# Altium schematic sheet SuperBC.SchDoc: =GSGS
size A3; Engineer: aloha; Address1: Unska 3; Address2: 10000 Zagreb; Address3: Croatia; SheetNumber: 2; SheetTotal: 4; : 2
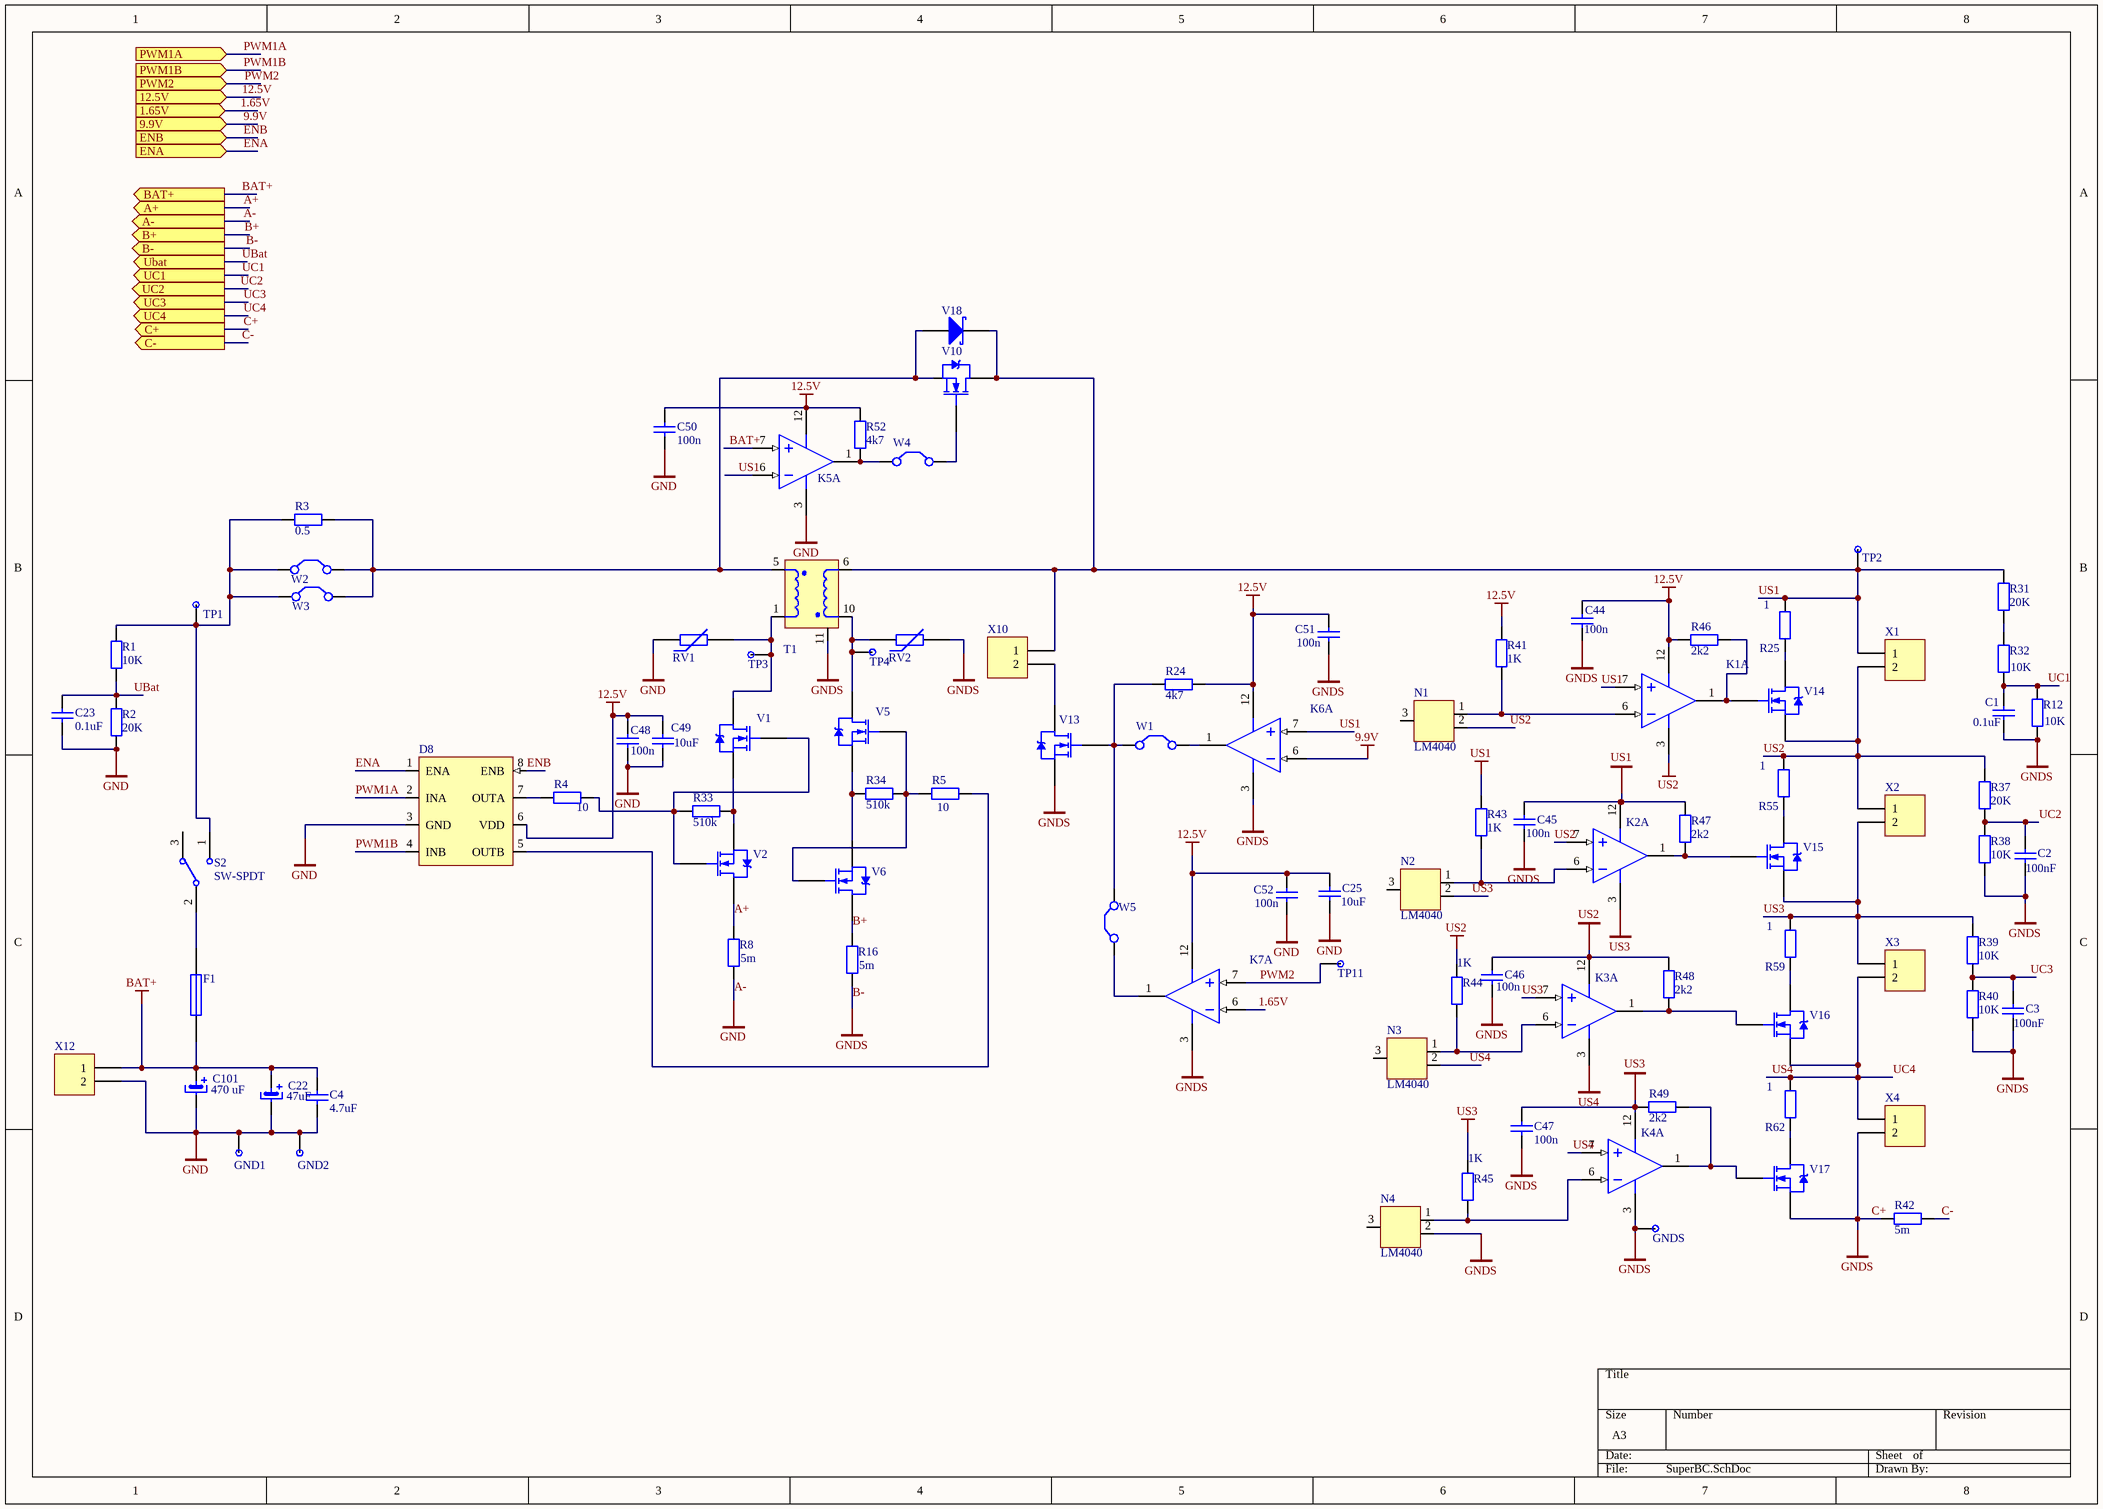
[diagram p0: SuperBC.SchDoc]

## Parts
C1  0.1uF  [C1210_L]
C2  value 100nF  [C1210_L]  (hidden comment: 0.1uF)
C3  value 100nF  [C1210_L]  (hidden comment: 0.1uF)
C4  4.7uF  [C0805]
C22  47uF  [SMD_CAP_RAD_8X10.2]
C23  0.1uF  [C1210_L]
C25  10uF  [C1210_L]
C44  100n  [C0805]
C45  100n  [C0805]
C46  100n  [C0805]
C47  100n  [C0805]
C48  100n  [C0805]
C49  10uF  [C1210_L]
C50  100n  [C0805]
C51  100n  [C0805]
C52  100n  [C0805]
C101  470 uF  [SMD_CAP_RAD_8X10.2]
D8  driver_mosfet  [SOIC8]  (value not drawn)
F1  Fuse 1  [C1206]  (value not drawn)
GND1  *  (value not drawn)
GND2  *  (value not drawn)
GNDS  *  (value not drawn)
K1  TLC3704QJ  [SOT-23]  (value not drawn)  (part A of 4)
K2  TLC3704QJ  [SOT-23]  (value not drawn)  (part A of 4)
K3  TLC3704QJ  [SOT-23]  (value not drawn)  (part A of 4)
K4  TLC3704QJ  [SOT-23]  (value not drawn)  (part A of 4)
K5  NCS2200  [SOT-23]  (value not drawn)  (part A of 4)
K6  TLC3704QJ  [SOT-23]  (value not drawn)  (part A of 4)
K7  TLC3704QJ  [SOT-23]  (value not drawn)  (part A of 4)
N1  LM4040  [SOT-23-ref_chip]
N2  LM4040  [SOT-23-ref_chip]
N3  LM4040  [SOT-23-ref_chip]
N4  LM4040  [SOT-23-ref_chip]
R1  10K  [C1210_L]
R2  20K  [C1210_L]
R3  0.5  [C2512]
R4  10  [C0805]
R5  10  [C0805]
R8  5m  [otpornik R8, R16]
R12  10K  [C1210_L]
R16  5m  [otpornik R8, R16]
R24  4k7  [C1206]
R25  1  [F za 7W otpornik]
R31  20K  [C1210_L]
R32  10K  [C1210_L]
R33  510k  [C1210_L]
R34  510k  [C1210_L]
R37  20K  [C1210_L]
R38  10K  [C1210_L]
R39  10K  [C1210_L]
R40  10K  [C1210_L]
R41  1K  [C1210_L]
R42  5m  [otpornik R8, R16]
R43  1K  [C1210_L]
R44  1K  [C1210_L]
R45  1K  [C1210_L]
R46  2k2  [C1210_L]
R47  2k2  [C1210_L]
R48  2k2  [C1210_L]
R49  2k2  [C1210_L]
R52  4k7  [C1206]
R55  1  [F za 7W otpornik]
R59  1  [F za 7W otpornik]
R62  1  [F za 7W otpornik]
RV1  Res Varistor  [C1210_L]  (value not drawn)
RV2  Res Varistor  [C1210_L]  (value not drawn)
S2  SW-SPDT  [toggle_switch]
T1  transformator  [F za transformator]  (value not drawn)
TP1  *  (value not drawn)
TP2  *  (value not drawn)
TP3  *  (value not drawn)
TP4  *  (value not drawn)
TP11  *  (value not drawn)
V1  NMOS-2  [SO-8L single_f]  (value not drawn)
V2  NMOS-2  [SO-8L single_f]  (value not drawn)
V5  NMOS-2  [SO-8L single_f]  (value not drawn)
V6  NMOS-2  [SO-8L single_f]  (value not drawn)
V10  MOSFET-N  [TO-252-3]  (value not drawn)
V13  MOSFET-N  [TO-252-3]  (value not drawn)
V14  NMOS-2  [SO-8L single_f]  (value not drawn)
V15  NMOS-2  [SO-8L single_f]  (value not drawn)
V16  NMOS-2  [SO-8L single_f]  (value not drawn)
V17  NMOS-2  [SO-8L single_f]  (value not drawn)
V18  Schottky Diode  [TO-220-AB]  (value not drawn)
W1  Jumper  [HDR1X2]  (value not drawn)
W2  Jumper 4.3A  [HDR1X2]  (value not drawn)
W3  Jumper 4.3A  [HDR1X2]  (value not drawn)
W4  Jumper  [HDR1X2]  (value not drawn)
W5  Jumper  [HDR1X2]  (value not drawn)
X1  Header 2  [F Header 1x2]  (value not drawn)
X2  Header 2  [F Header 1x2]  (value not drawn)
X3  Header 2  [F Header 1x2]  (value not drawn)
X4  Header 2  [F Header 1x2]  (value not drawn)
X10  Header 2  [F Header 1x2]  (value not drawn)
X12  Header 2  [F Header 1x2]  (value not drawn)

## Ports
1.65V (in), 9.9V (in), 12.5V (in), A+ (out), A- (out), B+ (out), B- (out), BAT+ (out), C+ (out), C- (out), ENA (in), ENB (in), PWM1A (in), PWM1B (in), PWM2 (in), Ubat (out), UC1 (out), UC2 (out), UC3 (out), UC4 (out)

## Nets
9.9V: K6.6(IN-) ; port 9.9V
12.5V: C25.2 C44.2 C48.2 C49.2 C50.2 C51.2 C52.2 D8.6(VDD) K1.12(V-) K5.12(V-) K6.12(V-) K7.12(V-) R24.2 R41.2 R46.1 R52.2 ; port 12.5V
A-: C4.1 C22.2 C23.1 C25.1 C48.1 C49.1 C50.1 C52.1 C101.2 D8.3(GND) GND1.1 GND2.1 K5.3(V+) R2.1 R8.1 RV1.1 X12.2 ; port A-  [also labelled GND]
B-: C1.1 C2.1 C3.1 C44.1 C45.1 C46.1 C47.1 C51.1 GNDS.1 K4.3(V+) K6.3(V+) K7.3(V+) N4.2 R12.1 R16.1 R38.1 R40.1 R42.2 RV2.2 T1.11 V13.2(S) V17.3(S) X4.2 ; port B-, port C+  [also labelled C+, GNDS]
BAT+: C4.2 C22.1 C101.1 F1.1 K5.7(IN+) X12.1 ; port BAT+
UC4: K3.3(V+) K4.7(IN+) N3.2 R62.2 V16.3(S) X3.2 X4.1 ; port UC4  [also labelled US4]
US1: C45.2 K1.7(IN+) K2.12(V-) K5.6(IN-) K6.7(IN+) R25.2 R31.2 R43.2 R47.2 T1.6 TP2.1 V10.3(D) V18.1(A) X1.1 X10.1
US2: C46.2 K1.3(V+) K2.7(IN+) K3.12(V-) N1.2 R37.2 R44.2 R48.2 R55.2 V14.3(S) X1.2 X2.1
US3: C47.2 K2.3(V+) K3.7(IN+) K4.12(V-) N2.2 R39.2 R45.2 R49.2 R59.2 V15.3(S) X2.2 X3.1
1.65V: K7.6(IN-) ; port 1.65V
A+: R8.2 V2.2(D) ; port A+
B+: R16.2 V6.2(D) ; port B+
C-: R42.1 ; port C-
ENA: D8.1(ENA) ; port ENA
ENB: D8.8(ENB) ; port ENB
PWM1A: D8.2(INA) ; port PWM1A
PWM1B: D8.4(INB) ; port PWM1B
PWM2: K7.7(IN+) TP11.1 ; port PWM2
UBat: C23.2 R1.1 R2.2 ; port Ubat
UC1: C1.2 R12.2 R32.1 ; port UC1
UC2: C2.2 R37.1 R38.2 ; port UC2
UC3: C3.2 R39.1 R40.2 ; port UC3
NetD8_5: D8.5(OUTB) R5.2
NetD8_7: D8.7(OUTA) R4.1
NetF1_2: F1.2 S2.2
NetK1_1: K1.1(OUT) R46.2 V14.1(G)
NetK1_6: K1.6(IN-) N1.1 R41.1
NetK2_1: K2.1(OUT) R47.1 V15.1(G)
NetK2_6: K2.6(IN-) N2.1 R43.1
NetK3_1: K3.1(OUT) R48.1 V16.1(G)
NetK3_6: K3.6(IN-) N3.1 R44.1
NetK4_1: K4.1(OUT) R49.1 V17.1(G)
NetK4_6: K4.6(IN-) N4.1 R45.1
NetK5_1: K5.1(OUT) R52.1 W4.1(C1)
NetK6_1: K6.1(OUT) W1.2(C2)
NetK7_1: K7.1(OUT) W5.1(C1)
NetR1_2: R1.2 R3.1 S2.1 TP1.1 W2.1(C1) W3.1(C1)
NetR3_2: R3.2 T1.5 V10.2(S) V18.2(K) W2.2(C2) W3.2(C2)
NetR4_2: R4.2 R33.1 V1.1(G) V2.1(G)
NetR5_1: R5.1 R34.2 V5.1(G) V6.1(G)
NetR24_1: R24.1 V13.1(G) W1.1(C1) W5.2(C2)
NetR25_1: R25.1 V14.2(D)
NetR31_1: R31.1 R32.2
NetR33_2: R33.2 V1.3(S) V2.3(S)
NetR34_1: R34.1 V5.3(S) V6.3(S)
NetR55_1: R55.1 V15.2(D)
NetR59_1: R59.1 V16.2(D)
NetR62_1: R62.1 V17.2(D)
NetRV1_2: RV1.2 T1.1 TP3.1 V1.2(D)
NetRV2_1: RV2.1 T1.10 TP4.1 V5.2(D)
NetV10_1: V10.1(G) W4.2(C2)
NetV13_3: V13.3(D) X10.2

Not connected (* = marked no-connect by the designer): N1 3; N2 3; N3 3; N4 3; S2 3

## Library data of the parts
C1 C23 = Cap: Capacitor; Value: 100nF; dobavljač: Farnell; kataloški broj: 1828960; cijena (funte): 0.241; opis komponente: Capacitor
C2 C3 = Cap: Capacitor; cijena (funte): 0.241; dobavljač: Farnell; kataloški broj: 1828960; opis komponente: Capacitor
C4 = Cap: Capacitor; dobavljač: Farnell; kataloški broj: 2346932; cijena (funte): 0.61; opis komponente: Capacitor 4.7uF ceramic; Value: 4.7uF
C22 = elko: dobavljač: Farnell; kataloški broj: 9696032; cijena (funte): 0.619; opis komponente: Electrolytic Capacitor; Value: 47uF
C25 = Cap: Capacitor; dobavljač: Farnell; kataloški broj: 2320931; opis komponente: Capacitor 100nF; Value: 10uF; cijena (funte): -
C44-C48 C50-C52 = Cap: Capacitor; Value: 100nF; cijena (funte): 0.141; dobavljač: Farnell; kataloški broj: 1856515; opis komponente: Capacitor 100nF
C49 = Cap: Capacitor; dobavljač: Farnell; kataloški broj: 2320931; Value: 10 uF; cijena (funte): -; opis komponente: Capacitor
C101 = elko: dobavljač: Farnell; kataloški broj: 1539457; cijena (funte): 0.794; opis komponente: Electrolytic Capacitor 470 µF; Value: 470 uF
D8 = driver_mosfet: cijena (funte): 1.43; dobavljač: Farnell; kataloški broj: 2782690; opis komponente: driver_mosfet
F1 = Fuse 1: Fuse; cijena (funte): 0.228; dobavljač: Farnell; kataloški broj: 2834845; opis komponente: osigurač 8A
GND1 GND2 GNDS TP1-TP4 TP11 = testpoint
K1-K7 = LP2901D: Low Power Quad Differential Comparator; cijena (funte): 0.239; dobavljač: Farnell; kataloški broj: 2510412; opis komponente: Analogue Comparator
N1-N4 = referentni chip: cijena (funte): 0.567; dobavljač: Farnell; kataloški broj: 9778322; opis komponente: chip za ref napon; Value: 2.5V
R1 R12 R32 = Res2: Resistor; dobavljač: Farnell; kataloški broj: 2502771; cijena (funte): 0.304; opis komponente: Resistor 10K
  R1 R12: Value: 10K
  R32: Value: 10k
R2 R31 = Res2: Resistor; dobavljač: Farnell; kataloški broj: 2380713; cijena (funte): 0.249; opis komponente: Resistor 20K; Value: 20K
R3 = Res2: Resistor; dobavljač: Farnell; kataloški broj: 1100070; cijena (funte): 0.60; Value: 0.5; opis komponente: Resistor
R4 R5 = Res2: Resistor; cijena (funte): 0.0786; dobavljač: Farnell; kataloški broj: 2380457; opis komponente: resitor 10 ohm; Value: 10
R8 R16 R42 = Res2: Resistor; dobavljač: Farnell; kataloški broj: 2363991; cijena (funte): 2.49; Value: 5m; opis komponente: Resistor
R24 R52 = Res2: Resistor; cijena (funte): 0.0274; dobavljač: Farnell; kataloški broj: 1100209; Value: 4k7; opis komponente: resistor
R25 R55 R59 R62 = Res2: Resistor; dobavljač: Farnell; kataloški broj: 1292518; cijena (funte): 0.426; opis komponente: Through Hole Resistor 7W; Value: 1
R33 R34 = Res2: Resistor; cijena (funte): 0.26; dobavljač: Farnell; kataloški broj: 1894354; Value: 510 k; opis komponente: resistor
R37 = Res2: Resistor; cijena (funte): 0.249; dobavljač: Farnell; kataloški broj: 2380713; opis komponente: Resistor 20K; Value: 20K
R38-R40 = Res2: Resistor; cijena (funte): 0.304; dobavljač: Farnell; kataloški broj: 2502771; opis komponente: Resistor 10K; Value: 10K
R41 R43-R45 = Res2: Resistor; cijena (funte): 0.0952; dobavljač: Farnell; kataloški broj: 2324006; Value: 1K; opis komponente: resistor
R46-R49 = Res2: Resistor; cijena (funte): 0.0949; dobavljač: Farnell; kataloški broj: 2324037; Value: 2k2; opis komponente: resistor
RV1 = Res Varistor: Varistor (Voltage-Sensitive Resistor); cijena (funte): 0.40; dobavljač: Farnell; kataloški broj: 2717744; opis komponente: Varistor (90V); Value: Varistor (90V)
RV2 = Res Varistor: Varistor (Voltage-Sensitive Resistor); cijena (funte): 0.40; dobavljač: Farnell; kataloški broj: 2717744; opis komponente: Varistor (90V); Value: MLV
S2 = SW-SPDT: SPDT Subminiature Toggle Switch, Right Angle Mounting, Vertical Actuation; cijena (funte): 2; dobavljač: Farnell; kataloški broj: 2292959; opis komponente: sklopka 5A
V1 V2 V5 V6 V14-V17 = NMOS-2: N-Channel Power MOSFET; dobavljač: Farnell; opis komponente: N-MOSFET
V10 V13 = NMOS-2: N-Channel Power MOSFET; cijena (funte): 0.585; dobavljač: Farnell; kataloški broj: 1794799; opis komponente: N-MOSFET
V18 = D Schottky: cijena (funte): 0.26; dobavljač: Farnell; kataloški broj: 2675118; opis komponente: Schottky Diode
W1 W4 W5 = Jumper: Jumper Wire; cijena (funte): 0.0874; dobavljač: Farnell; kataloški broj: 2396303; opis komponente: jumper
W2 W3 = Jumper: Jumper Wire; cijena (funte): 0.149; dobavljač: Farnell; kataloški broj: 2505007; opis komponente: jumper 4.3A
X1-X4 X10 X12 = Header 2: Header, 2-Pin; cijena (funte): 0.239; dobavljač: Farnell; kataloški broj: 2396251; opis komponente: Header, 2-Pin